# EAGLE design avrusbboot_example (EAGLE 9.6.2)
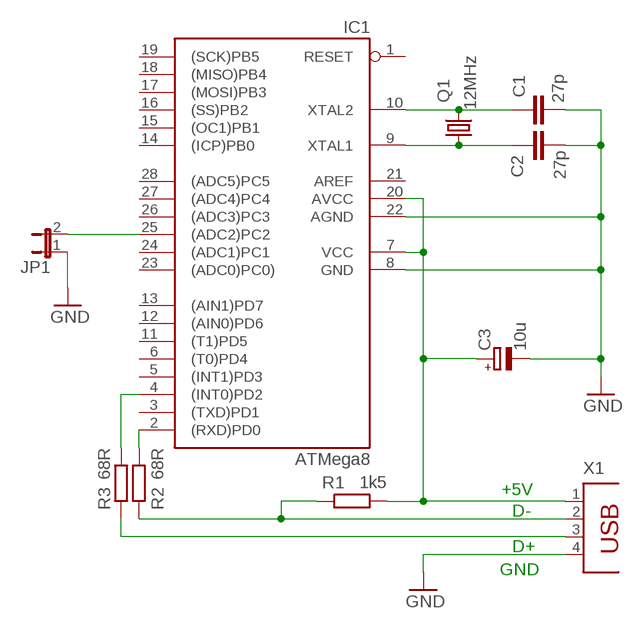
[diagram p0: schematic, sheet 1]

## Parts
C1  27p  C-EU025-024X044  [C025-024X044]
C2  27p  C-EU025-024X044  [C025-024X044]
C3  10u  CPOL-EUE2.5-5  [E2,5-5]
IC1  ATMega8  AT90S4433P  [DIL28-3]
JP1  JP1E  [JP1]
Q1  12MHz  CRYTALHC49S  [HC49/S]
R1  1k5  R-EU_0207/7  [0207/7]
R2  68R  R-EU_0207/7  [0207/7]
R3  68R  R-EU_0207/7  [0207/7]
X1  PN61729  [PN61729]

## Nets
D_N [Data]: R1.1 R2.1 X1.2
D_P [Data]: R3.1 X1.3
GND: C1.2 C2.2 C3.- IC1.8(GND) IC1.22(AGND) JP1.1 X1.4
N$1: IC1.25((ADC2)PC2) JP1.2
N$21: C1.1 IC1.10(XTAL2) Q1.2
N$22: C2.1 IC1.9(XTAL1) Q1.1
R_N [Data]: IC1.2((RXD)PD0) R2.2
R_P [Data]: IC1.4((INT0)PD2) R3.2
VCC: C3.+ IC1.7(VCC) IC1.20(AVCC) R1.2 X1.1
Unconnected: IC1.1(RESET) IC1.3((TXD)PD1) IC1.5((INT1)PD3) IC1.6((T0)PD4) IC1.11((T1)PD5) IC1.12((AIN0)PD6) IC1.13((AIN1)PD7) IC1.14((ICP)PB0) IC1.15((OC1)PB1) IC1.16((SS)PB2) IC1.17((MOSI)PB3) IC1.18((MISO)PB4) IC1.19((SCK)PB5) IC1.23((ADC0)PC0)) IC1.24((ADC1)PC1) IC1.26((ADC3)PC3) IC1.27((ADC4)PC4) IC1.28((ADC5)PC5)

## Notes on the sheet
- +5V
- D-
- D+
- GND

## Power pins joined to a net without a drawn wire
AREF: IC1.21(AREF)

## Library data of the parts
C1 C2 = rcl:C-EU: CAPACITOR, European symbol
C3 = rcl:CPOL-EU: POLARIZED CAPACITOR, European symbol
IC1 = atmel:AT90S4433: MICROCONTROLLER 4 Kbytes FLASH 128 bytes SRAM 256 bytes EEPROM UART 6-channel 10 bit ADC
JP1 = jumper:JP1E: JUMPER
Q1 = crystal:CRYTAL: CRYSTAL
R1-R3 = rcl:R-EU_: RESISTOR, European symbol
X1 = con-berg:PN61729: BERG USB connector

## Net classes
1 Data: width 0.813 mm, clearance 0.406 mm

## Board
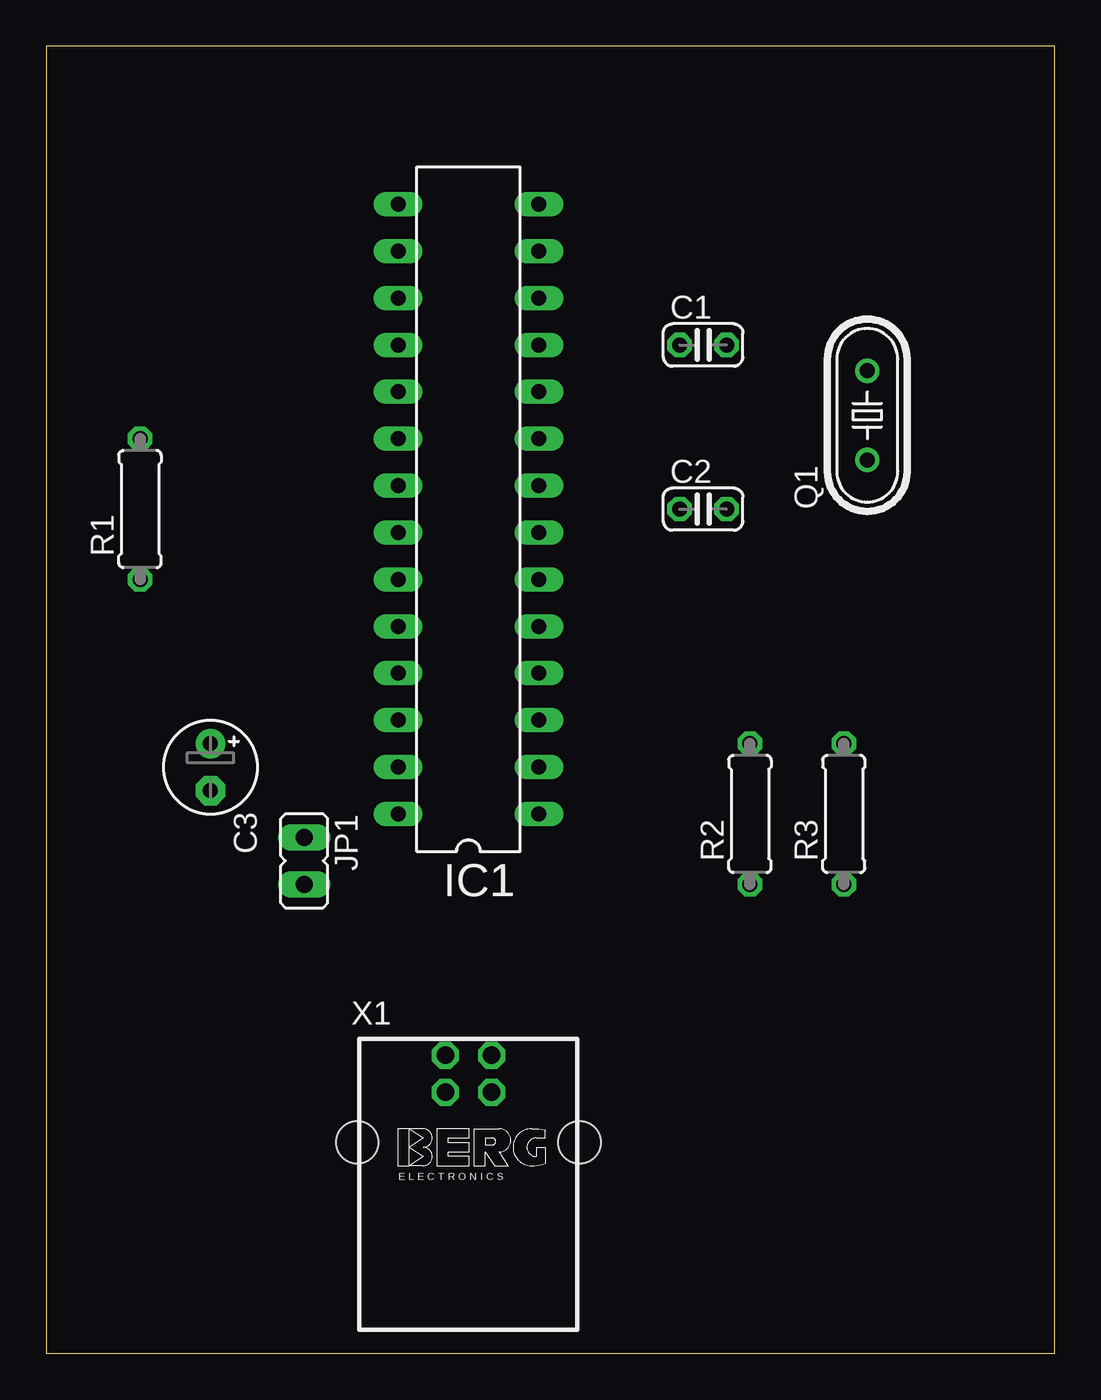
[diagram p1: board, top side]
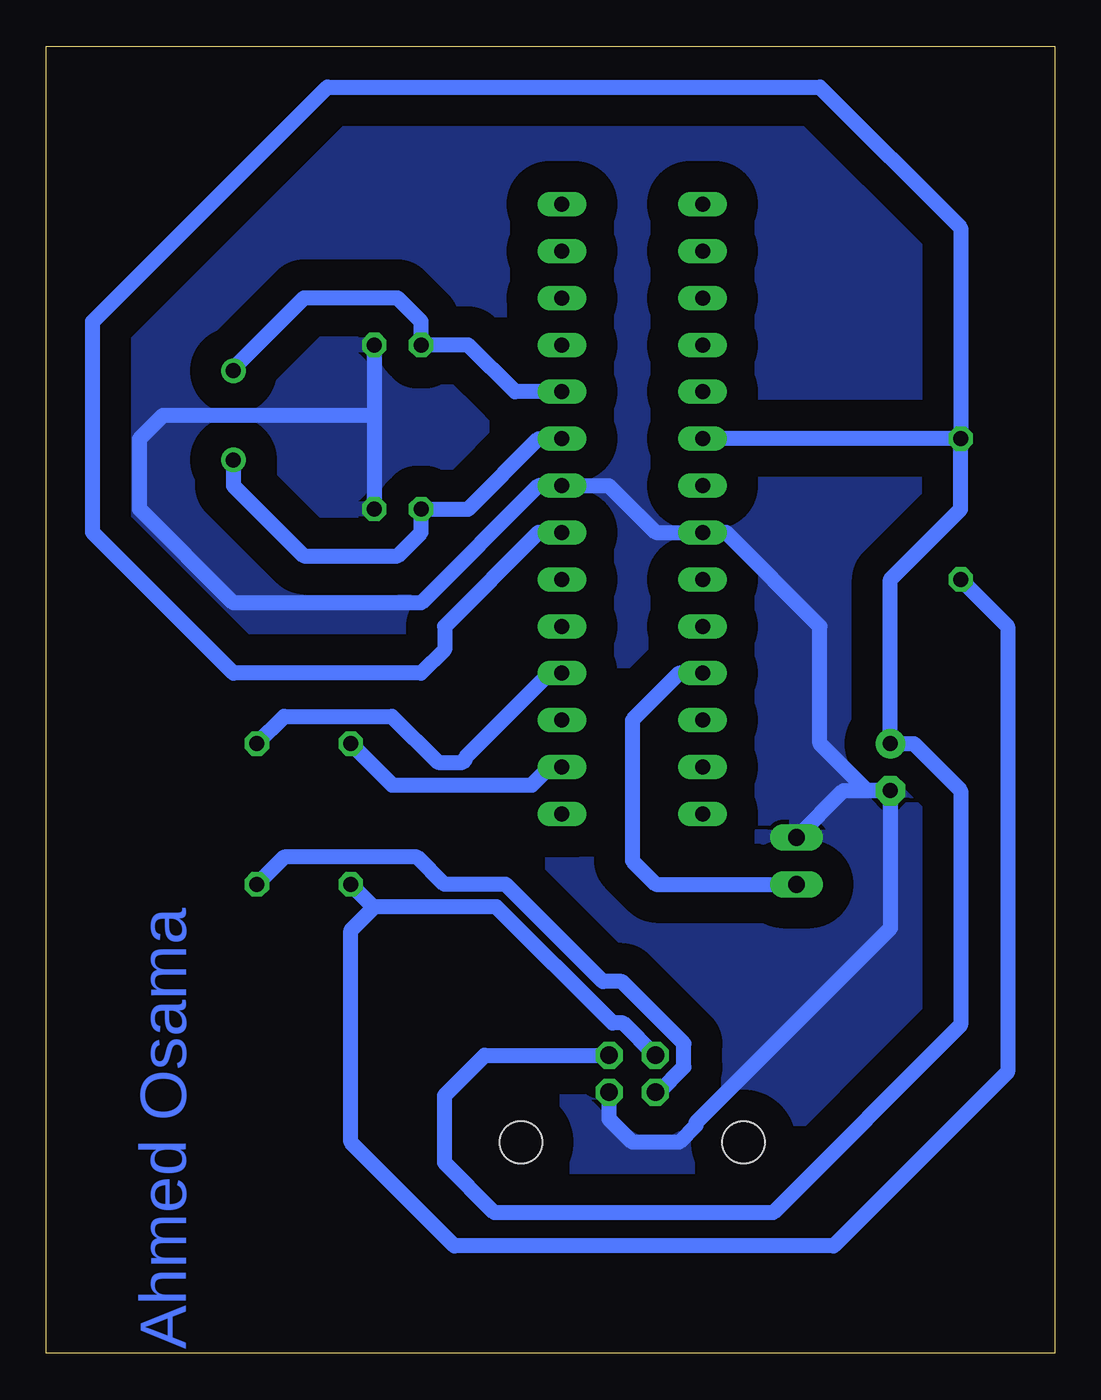
[diagram p2: board, bottom side, seen from below]

Size 54.59 x 70.79 mm. Coordinates in mm from the lower left corner, seen from the top.
Outline: 0,0 54.59,0 54.59,70.79 0,70.79 0,0
Copper layers (1*16): Top 0.035mm / dielectric 1.5mm / Bottom 0.035mm
Design rules "default": minimum track width 6mil, minimum drill 0.35mm, track to track 6mil, track to pad 6mil, pad to pad 6mil, via to via 6mil, smd to smd 6mil, copper to edge 40mil, drill to drill 6mil, minimum pad ring 10mil, minimum via ring 8mil, stop-mask expansion 4mil, vias tented up to drill 0mil, thermal gap 10mil

### Footprints (pad centres in the part's own frame; a part is rotated, then mirrored left to right if it is on the bottom)
C025-024X044 = drill 0.813 octagon: 1 -1.27,0; 2 1.27,0
E2,5-5 = drill 0.813 pad 1.6: + -1.27,0 | drill 0.813 pad 1.6 octagon: - 1.27,0
DIL28-3 = drill 0.813 long: 1 -16.51,-3.81; 2 -13.97,-3.81; 3 -11.43,-3.81; 4 -8.89,-3.81; 5 -6.35,-3.81; 6 -3.81,-3.81; 7 -1.27,-3.81; 8 1.27,-3.81; 9 3.81,-3.81; 10 6.35,-3.81; 11 8.89,-3.81; 12 11.43,-3.81; 13 13.97,-3.81; 14 16.51,-3.81; 15 16.51,3.81; 16 13.97,3.81; 17 11.43,3.81; 18 8.89,3.81; 19 6.35,3.81; 20 3.81,3.81; 21 1.27,3.81; 22 -1.27,3.81; 23 -3.81,3.81; 24 -6.35,3.81; 25 -8.89,3.81; 26 -11.43,3.81; 27 -13.97,3.81; 28 -16.51,3.81
JP1 = drill 0.914 long: 1 0,-1.27; 2 0,1.27
HC49/S = drill 0.813: 1 -2.413,0; 2 2.413,0
0207/7 = drill 0.813 octagon: 1 -3.81,0; 2 3.81,0
PN61729 = drill 0.95 octagon: 1 1.25,4.71; 2 -1.25,4.71; 3 -1.25,2.71; 4 1.25,2.71 | hole 2.3: -6.02,0; 6.02,0

### Placement (x,y rotation side)
C1  35.56,54.61 0 top
C2  35.56,45.72 0 top
C3  8.89,31.75 270 top
IC1  22.86,45.72 90 top
JP1  13.97,26.67 180 top
Q1  44.45,50.8 90 top
R1  5.08,45.72 90 top
R2  38.1,29.21 90 top
R3  43.18,29.21 90 top
X1  22.86,11.43 0 top

### Tracks (layer width: path | path; a pad name or v marks a point on that pad's centre or on a via)
D_N
  Bottom 0.813: R2.1 36.88,24.18 36.83,24.18 | 36.83,24.18 30.22,24.18 23.93,17.89 23.36,17.89 X1.2 | R1.1 2.54,39.37 2.54,15.24 11.96,5.82 32.49,5.82 38.1,11.43 38.1,22.91 36.83,24.18
D_P  (via drill 0.35)
  Bottom 0.813: R3.1 41.71,26.87 34.51,26.87 33.03,25.4 29.72,25.4 24.45,20.13 23.42,20.13 20.07,16.78 20.07,15.5 21.43,14.14 X1.3
  other vias: 21.61,14.14
GND
  Bottom 0.813: C3.- 10.16,30.48 12.7,33.02 12.7,39.37 17.78,44.45 IC1.22 21.59,44.45 24.13,46.99 IC1.8 27.94,46.99 34.29,40.64 44.45,40.64 49.53,45.72 49.53,49.53 48.26,50.8 36.83,50.8 | C3.- 8.89,23.02 19.41,12.5 19.41,12.34 20.32,11.43 22.86,11.43 24.11,12.68 X1.4 | C1.2 36.83,50.8 | 36.83,50.8 C2.2 | JP1.1 11.43,30.48 C3.-
  pour Bottom (isolate 1.676): 0,0 0,71.12 54.61,71.12 54.61,0
N$1
  Bottom 0.813: IC1.25 20.32,36.83 22.86,34.29 22.86,26.67 21.59,25.4 JP1.2
N$21
  Bottom 0.813: IC1.10 29.21,52.07 31.75,54.61 C1.1 34.29,55.88 35.56,57.15 40.64,57.15 44.45,53.34 Q1.2
N$22
  Bottom 0.813: IC1.9 27.94,49.53 31.75,45.72 C2.1 34.29,44.45 35.56,43.18 40.64,43.18 44.45,46.99 Q1.1
R_N
  Bottom 0.813: R2.2 35.86,30.78 28.3,30.78 27.33,31.75 IC1.2
R_P
  Bottom 0.813: R3.2 41.71,34.49 35.87,34.49 33.38,32 32.05,32 31.93,32.12 31.93,32.23 27.33,36.83 IC1.4
VCC
  Bottom 0.813: R1.2 IC1.20 | X1.1 30.85,16.14 33.02,13.97 33.02,10.32 30.32,7.62 15.24,7.62 5.08,17.78 5.08,30.48 7.62,33.02 C3.+ 8.89,41.91 5.08,45.72 R1.2 | IC1.7 27.94,44.45 33.02,39.37 33.02,38.1 34.29,36.83 44.45,36.83 52.07,44.45 52.07,55.88 39.37,68.58 12.7,68.58 5.08,60.96 R1.2

### Text on the board
Bottom: Ahmed Osama